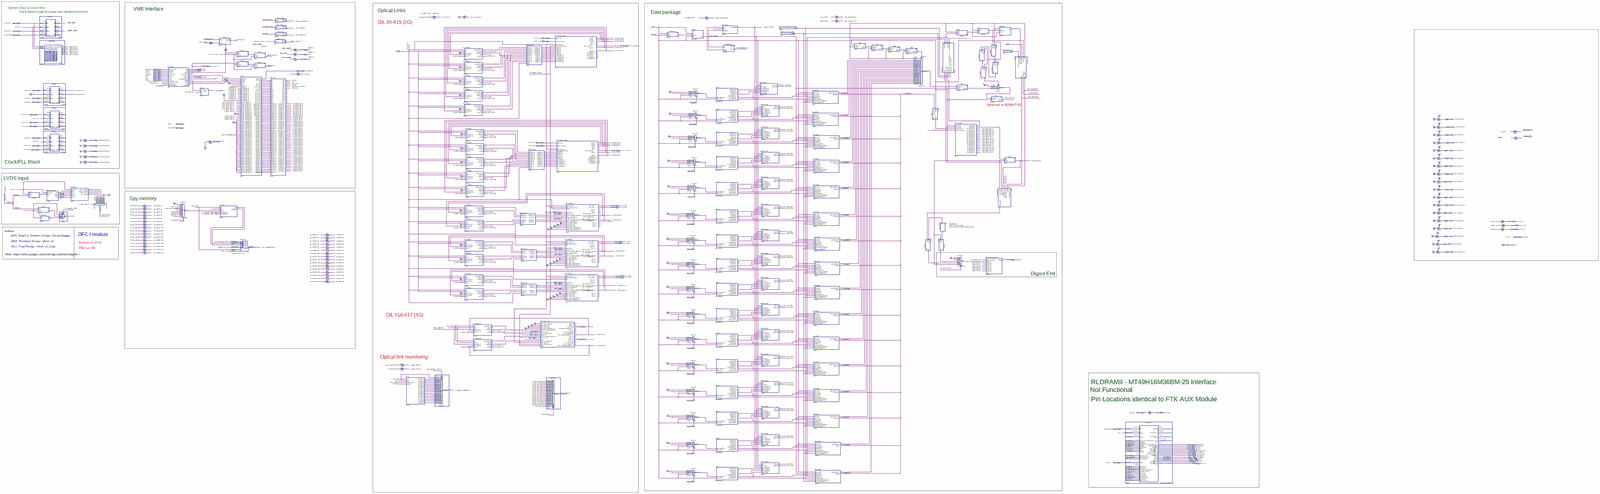
[diagram p0: schematic sheet, whole]
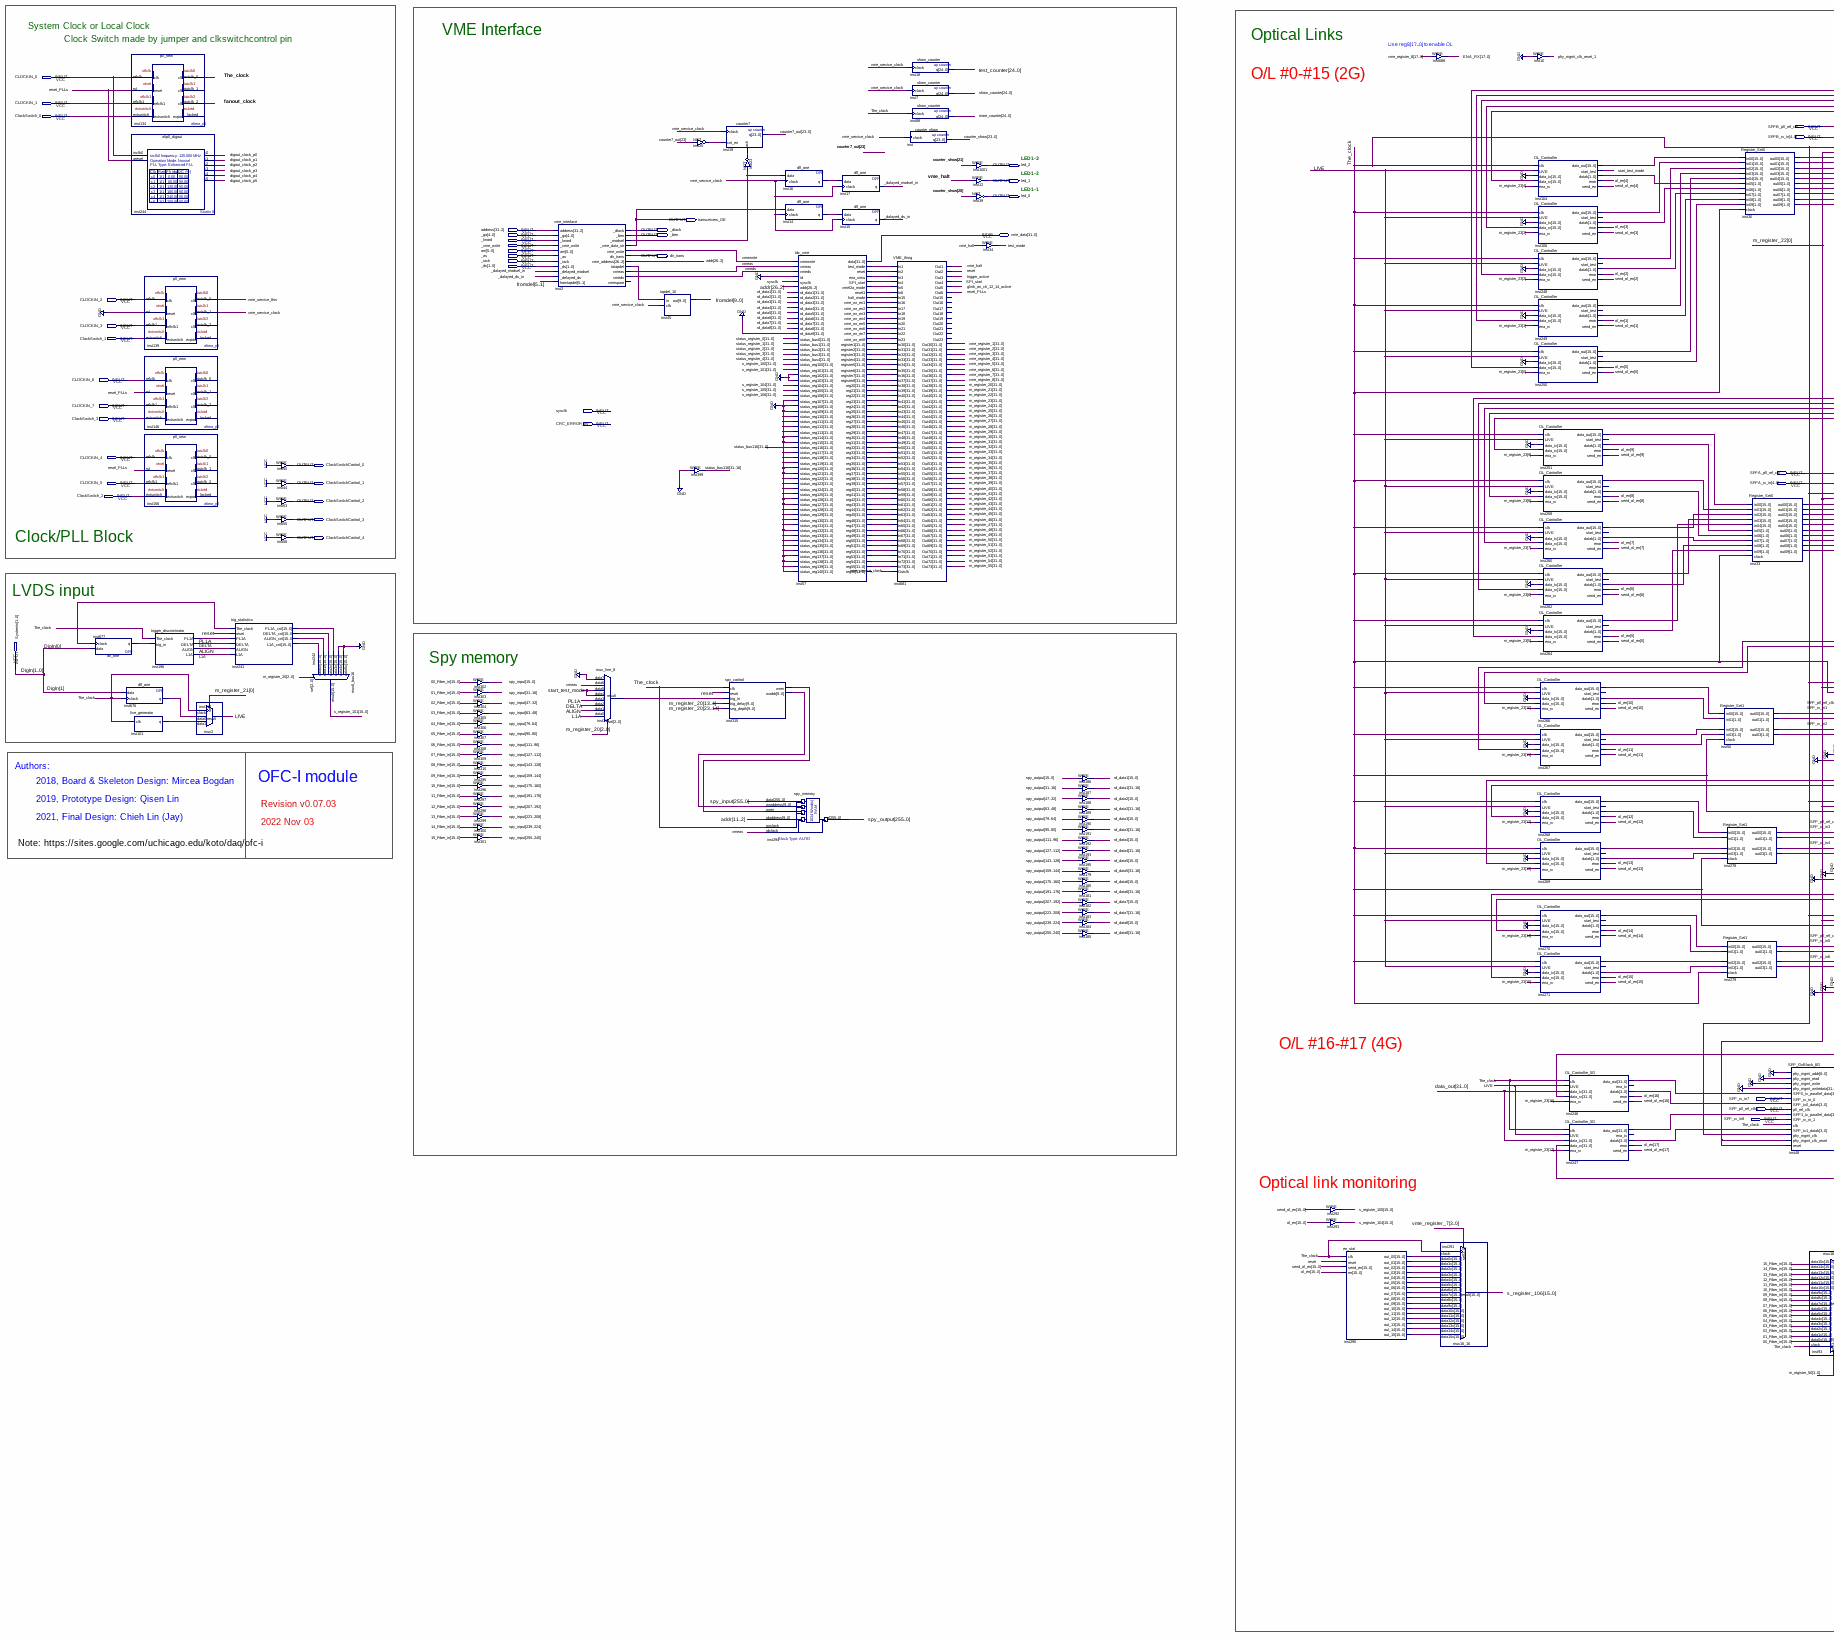
[diagram p1: schematic sheet, left part]
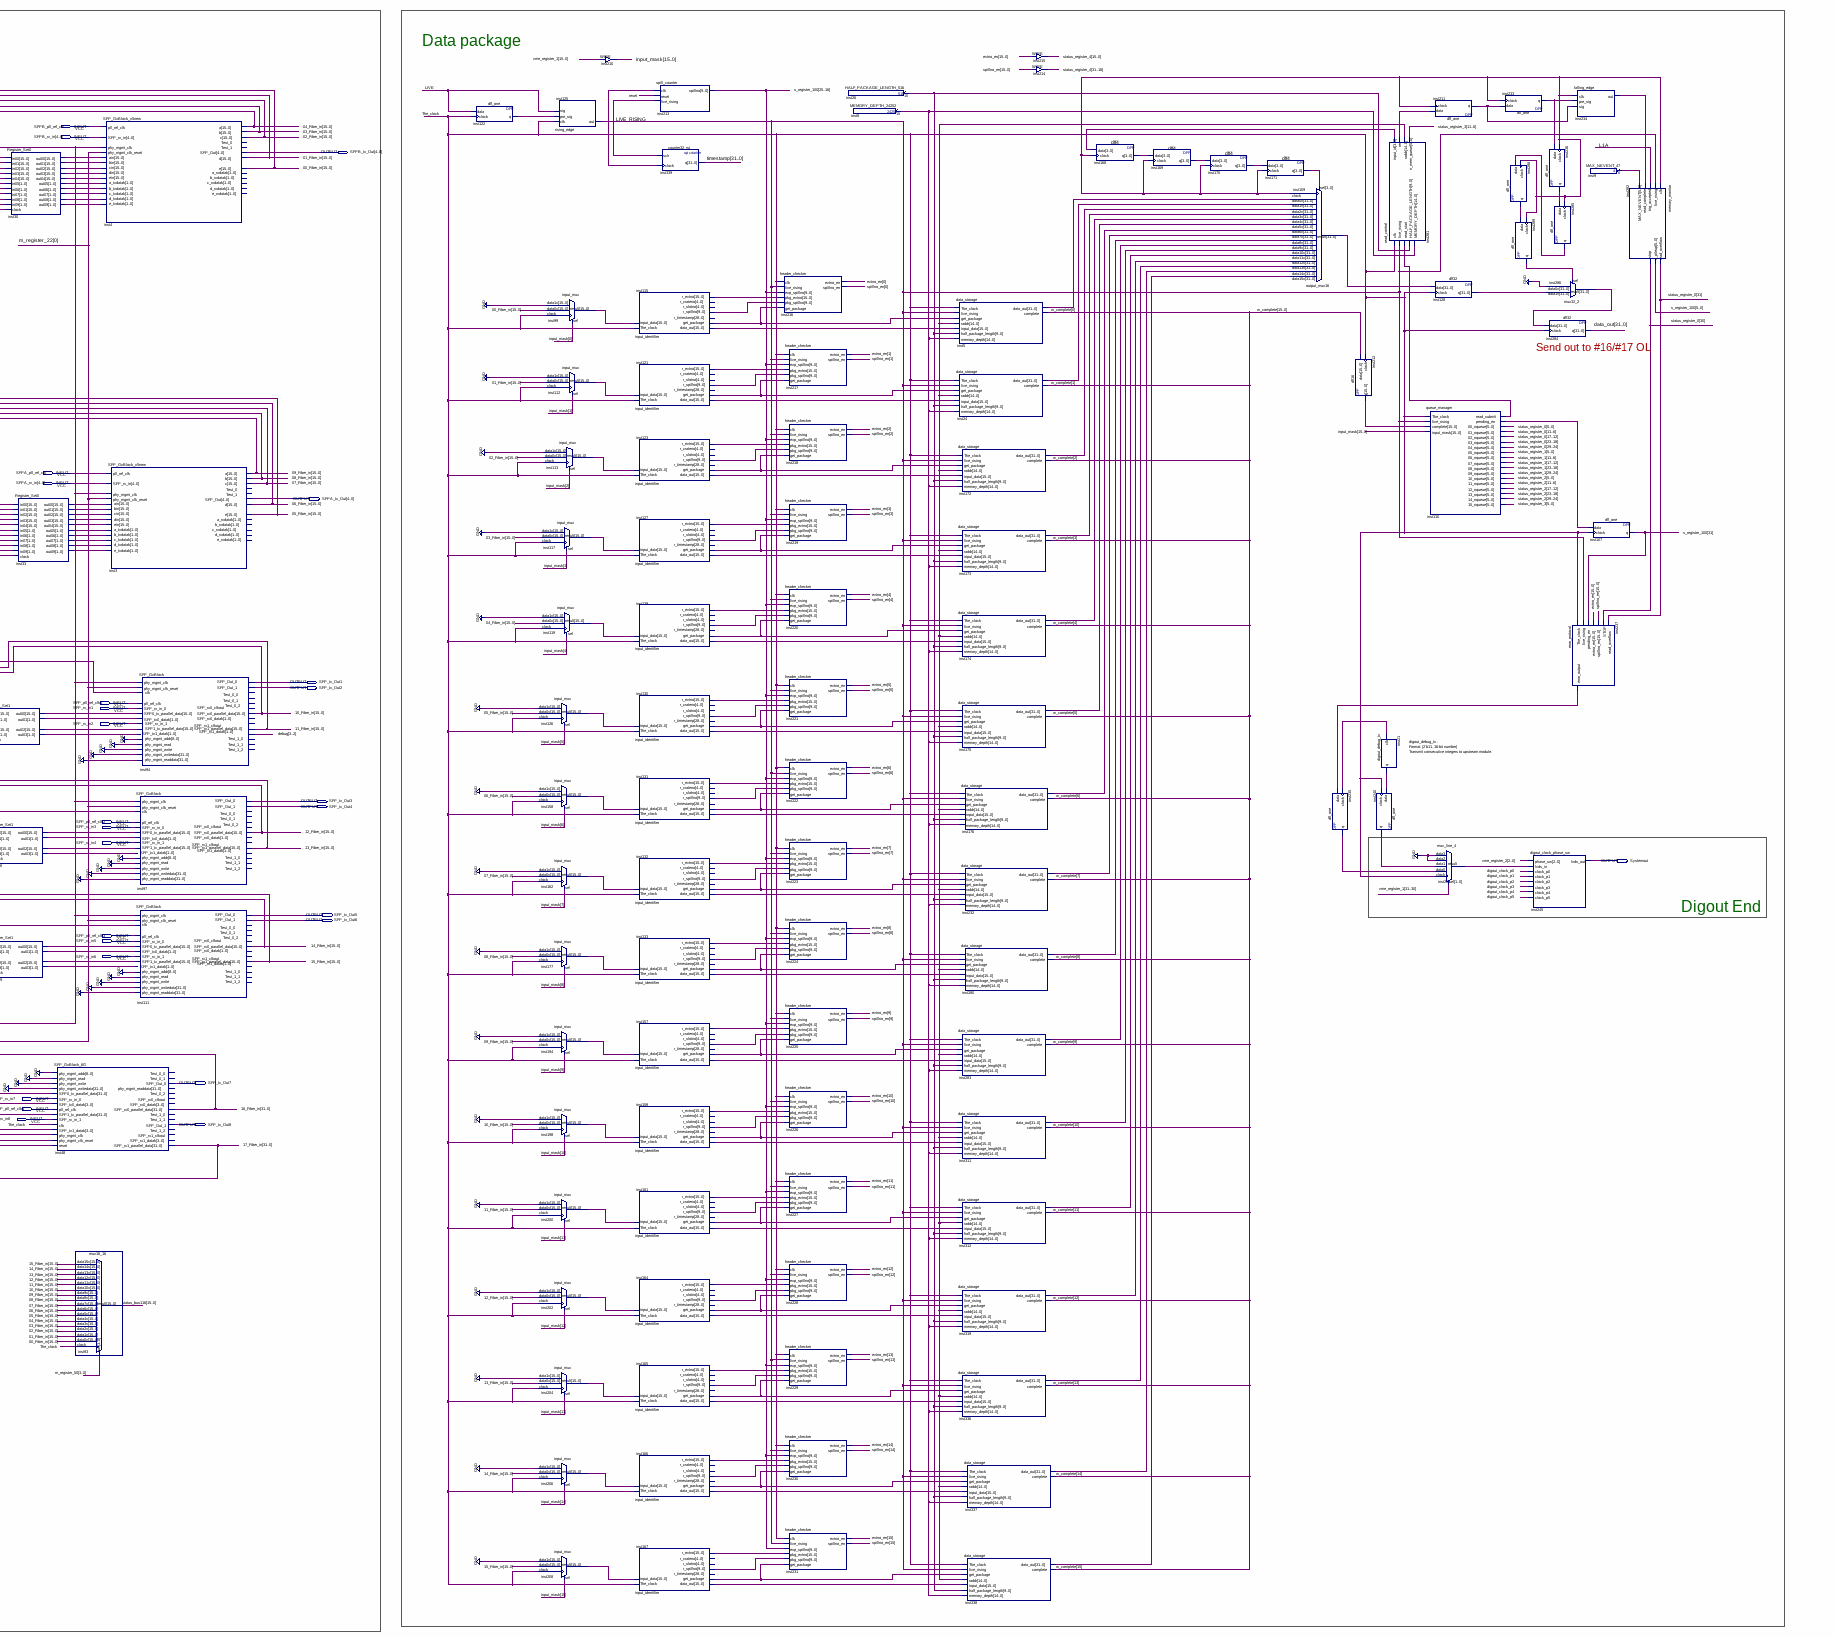
[diagram p2: schematic sheet, centre part]
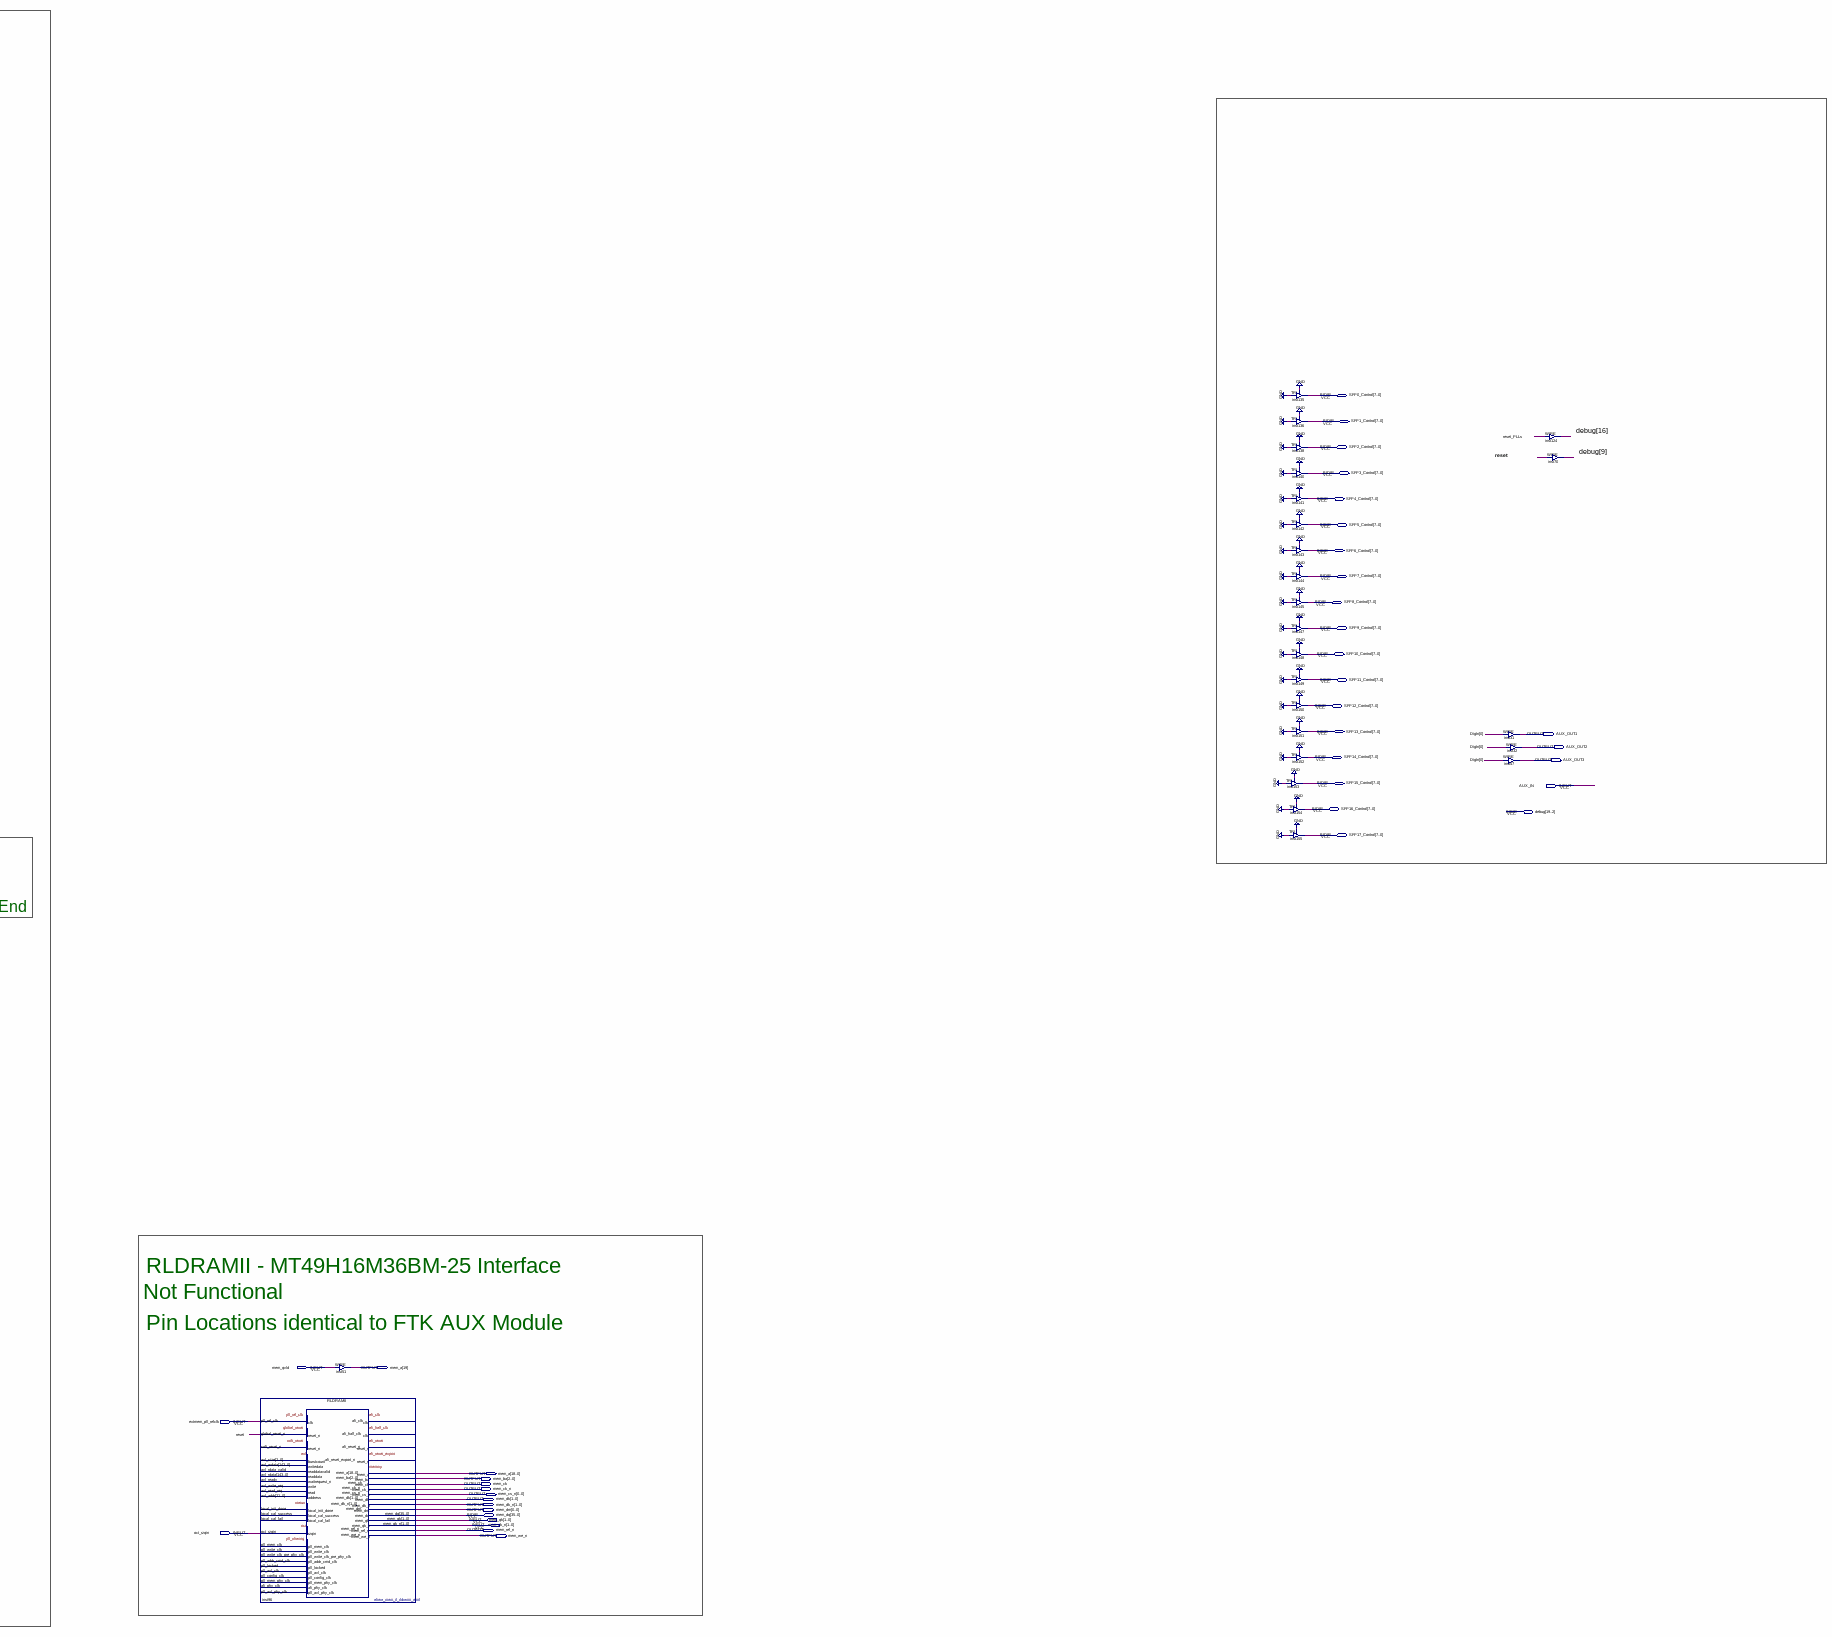
[diagram p3: schematic sheet, right part]
// Quartus schematic Rx.bdf as structural Verilog: 233 symbols, 103 pins
module Rx (
  input  CLOCKIN_0,
  input  CLOCKIN_1,
  input  ClockSwitch_0,
  input  SFPB_pll_ref_clk,
  input  [4:0] SFPB_rx_in,
  input  [31:2] address,
  input  [4:0] _ga,
  input  _lword,
  input  _vme_write,
  input  [5:0] am,
  input  _as,
  input  _iack,
  input  [1:0] _ds,
  input  CLOCKIN_2,
  input  CLOCKIN_3,
  input  ClockSwitch_1,
  input  CLOCKIN_6,
  input  CLOCKIN_7,
  input  sysclk,
  input  ClockSwitch_3,
  input  CRC_ERROR_IN,
  input  CLOCKIN_4,
  input  SFPA_pll_ref_clk,
  input  CLOCKIN_5,
  input  [4:0] SFPA_rx_in,
  input  ClockSwitch_2,
  input  [1:0] Systemin,
  input  SFP_pll_ref_clk1,
  input  SFP_rx_in1,
  input  SFP_rx_in2,
  input  AUX_IN,
  input  SFP_pll_ref_clk2,
  input  SFP_rx_in3,
  input  SFP_rx_in4,
  input  SFP_pll_ref_clk3,
  input  SFP_rx_in5,
  input  SFP_rx_in6,
  input  SFP_rx_in7,
  input  SFP_pll_ref_clk4,
  input  SFP_rx_in8,
  input  mem_qvld,
  input  extmem_pll_refclk,
  input  [1:0] mem_qk,
  input  [1:0] mem_qk_n,
  input  oct_rzqin,
  inout  [31:0] vme_data,
  inout  [7:0] SFP0_Control,
  inout  [7:0] SFP1_Control,
  inout  [7:0] SFP2_Control,
  inout  [7:0] SFP3_Control,
  inout  [7:0] SFP4_Control,
  inout  [7:0] SFP5_Control,
  inout  [7:0] SFP6_Control,
  inout  [7:0] SFP7_Control,
  inout  [7:0] SFP8_Control,
  inout  [7:0] SFP9_Control,
  inout  [7:0] SFP10_Control,
  inout  [7:0] SFP11_Control,
  inout  [7:0] SFP12_Control,
  inout  [7:0] SFP13_Control,
  inout  [7:0] SFP14_Control,
  inout  [7:0] SFP15_Control,
  inout  [7:0] SFP16_Control,
  inout  [19:2] debug,
  inout  [7:0] SFP17_Control,
  inout  [35:0] mem_dq,
  output [4:0] SFPB_tx_Out,
  output led_2,
  output led_1,
  output led_0,
  output transceivers_OE,
  output _dtack,
  output _berr,
  output dir_trans,
  output ClockSwitchControl_0,
  output ClockSwitchControl_1,
  output [4:0] SFPA_tx_Out,
  output ClockSwitchControl_2,
  output ClockSwitchControl_3,
  output ClockSwitchControl_4,
  output SFP_tx_Out1,
  output SFP_tx_Out2,
  output AUX_OUT1,
  output AUX_OUT2,
  output AUX_OUT3,
  output SFP_tx_Out3,
  output SFP_tx_Out4,
  output Systemout,
  output SFP_tx_Out5,
  output SFP_tx_Out6,
  output SFP_tx_Out7,
  output SFP_tx_Out8,
  output [19:0] mem_a,
  output [2:0] mem_ba,
  output mem_ck,
  output mem_ck_n,
  output [0:0] mem_cs_n,
  output [1:0] mem_dk,
  output [1:0] mem_dk_n,
  output [0:0] mem_dm,
  output mem_ref_n,
  output mem_we_n
);

  wire _dalayed_ds_in, _dalayed_modsel_in, ALIGN, DELTA, digout_clock_p0, digout_clock_p1, digout_clock_p2,
       digout_clock_p3, digout_clock_p4, digout_clock_p5, fanout_clock, glink_on_ch_12_14_active,
       inst2__modsel, inst2_totapdel, inst14_q, inst16_q, inst21_q, inst23_out, inst25_out, inst57_ena_simu,
       inst57_halt_mode, inst57_reset, inst57_reset1, inst57_spi_start, inst57_test_mode, inst57_vme_wr_en1,
       inst57_vme_wr_en2, inst57_vme_wr_en3, inst57_vme_wr_en4, inst57_vme_wr_en5, inst57_vme_wr_en6,
       inst57_vme_wr_en7, inst57_vme_wr_en8, inst57_vmel2a_mode, inst101_q, inst110_pending_err,
       inst110_read_submit, inst115_get_package, inst121_get_package, inst122_q, inst123_get_package,
       inst127_get_package, inst129_get_package, inst130_get_package, inst131_get_package,
       inst132_get_package, inst133_get_package, inst157_get_package, inst159_get_package,
       inst161_get_package, inst164_get_package, inst165_get_package, inst166_get_package,
       inst167_get_package, inst211_q, inst233_q, inst234_out, inst235_q, inst236_q, inst237_error_output,
       inst238_result, inst240_q, inst281_ren, inst285_q, inst288_q, inst289_q, inst313_result, inst315_wren,
       inst676_q, inst677_q, L1A, LIVE, LIVE_RISING, phy_mgmt_clk_reset_1, PL1A, reset, reset_PLLs,
       SPI_start, start_test_mode, test_mode, The_clock, trigger_active, vme_halt, vme_service_8ns,
       vme_service_clock, vmeas, vmeds, vmewrite;
  wire [1:0] inst30_out05, inst30_out06, inst30_out07, inst30_out08, inst30_out09, inst33_out05,
       inst33_out06, inst33_out07, inst33_out08, inst33_out09, inst50_out01, inst50_out03, inst104_datak,
       inst106_datak, inst248_datak, inst249_datak, inst250_datak, inst251_datak, inst258_datak,
       inst260_datak, inst262_datak, inst264_datak, inst266_datak, inst267_datak, inst268_datak,
       inst269_datak, inst270_datak, inst271_datak, inst278_out01, inst278_out03, inst279_out01,
       inst279_out03;
  wire [3:0] inst168_q, inst169_q, inst170_q, inst171_q, inst246_datak, inst247_datak, inst281_input_id;
  wire [5:0] inst9_result;
  wire [9:0] fromdel, inst26_result, inst115_r_spillno, inst121_r_spillno, inst123_r_spillno,
       inst127_r_spillno, inst129_r_spillno, inst130_r_spillno, inst131_r_spillno, inst132_r_spillno,
       inst133_r_spillno, inst157_r_spillno, inst159_r_spillno, inst161_r_spillno, inst164_r_spillno,
       inst165_r_spillno, inst166_r_spillno, inst167_r_spillno, inst315_waddr;
  wire [14:0] inst8_result, inst281_raddr;
  wire [15:0] \00_Fiber_in , \01_Fiber_in , \02_Fiber_in , \03_Fiber_in , \04_Fiber_in , \05_Fiber_in ,
       \06_Fiber_in , \07_Fiber_in , \08_Fiber_in , \09_Fiber_in , \10_Fiber_in , \11_Fiber_in ,
       \12_Fiber_in , \13_Fiber_in , \14_Fiber_in , \15_Fiber_in , evtno_err, input_mask, inst30_out00,
       inst30_out01, inst30_out02, inst30_out03, inst30_out04, inst33_out00, inst33_out01, inst33_out02,
       inst33_out03, inst33_out04, inst50_out00, inst50_out02, inst99_result, inst104_data_out,
       inst106_data_out, inst112_result, inst113_result, inst115_data_out, inst115_r_evtno, inst117_result,
       inst119_result, inst121_data_out, inst121_r_evtno, inst123_data_out, inst123_r_evtno, inst126_result,
       inst127_data_out, inst127_r_evtno, inst129_data_out, inst129_r_evtno, inst130_data_out,
       inst130_r_evtno, inst131_data_out, inst131_r_evtno, inst132_data_out, inst132_r_evtno,
       inst133_data_out, inst133_r_evtno, inst157_data_out, inst157_r_evtno, inst158_result,
       inst159_data_out, inst159_r_evtno, inst161_data_out, inst161_r_evtno, inst162_result,
       inst164_data_out, inst164_r_evtno, inst165_data_out, inst165_r_evtno, inst166_data_out,
       inst166_r_evtno, inst167_data_out, inst167_r_evtno, inst177_result, inst194_result, inst198_result,
       inst200_result, inst202_result, inst204_result, inst206_result, inst208_result, inst212_q,
       inst241_align_cnt, inst241_delta_cnt, inst241_l1a_cnt, inst241_pl1a_cnt, inst248_data_out,
       inst249_data_out, inst250_data_out, inst251_data_out, inst258_data_out, inst260_data_out,
       inst262_data_out, inst264_data_out, inst266_data_out, inst267_data_out, inst268_data_out,
       inst269_data_out, inst270_data_out, inst271_data_out, inst278_out00, inst278_out02, inst279_out00,
       inst279_out02, inst290_out_00, inst290_out_01, inst290_out_02, inst290_out_03, inst290_out_04,
       inst290_out_05, inst290_out_06, inst290_out_07, inst290_out_08, inst290_out_09, inst290_out_10,
       inst290_out_11, inst290_out_12, inst290_out_13, inst290_out_14, inst290_out_15, spillno_err,
       w_complete;
  wire [17:0] ENA_RX, ol_err, send_ol_err;
  wire [23:0] counter7_out, counter_show;
  wire [24:0] more_counter, show_counter, test_counter;
  wire [26:2] addr;
  wire [31:0] \16_Fiber_in , \17_Fiber_in , data_out, inst5_data_out, inst24_data_out, inst57_reg20,
       inst57_reg21, inst57_reg22, inst57_reg23, inst57_reg24, inst57_reg25, inst57_reg26, inst57_reg27,
       inst57_reg28, inst57_reg29, inst57_reg30, inst57_reg31, inst57_reg32, inst57_reg33, inst57_reg34,
       inst57_reg35, inst57_reg36, inst57_reg37, inst57_reg38, inst57_reg39, inst57_reg40, inst57_reg41,
       inst57_reg42, inst57_reg43, inst57_reg44, inst57_reg45, inst57_reg46, inst57_reg47, inst57_reg48,
       inst57_reg49, inst57_reg50, inst57_reg51, inst57_reg52, inst57_reg53, inst57_reg54, inst57_reg55,
       inst57_register1, inst57_register2, inst57_register3, inst57_register4, inst57_register5,
       inst57_register6, inst57_register7, inst57_register8, inst94_phy_mgmt_readdata,
       inst97_phy_mgmt_readdata, inst109_result, inst111_phy_mgmt_readdata, inst128_q, inst172_data_out,
       inst173_data_out, inst174_data_out, inst175_data_out, inst176_data_out, inst232_data_out,
       inst246_data_out, inst247_data_out, inst280_data_out, inst283_data_out, inst286_result,
       inst311_data_out, inst312_data_out, inst319_data_out, inst336_data_out, inst337_data_out,
       inst338_data_out, m_register_20, m_register_21, m_register_22, m_register_23, m_register_24,
       m_register_25, m_register_26, m_register_27, m_register_28, m_register_29, m_register_30,
       m_register_31, m_register_32, m_register_33, m_register_34, m_register_35, m_register_36,
       m_register_37, m_register_38, m_register_39, m_register_40, m_register_41, m_register_42,
       m_register_43, m_register_44, m_register_45, m_register_46, m_register_47, m_register_48,
       m_register_49, m_register_50, m_register_51, m_register_52, m_register_53, m_register_54,
       m_register_55, rd_data1, rd_data2, rd_data3, rd_data4, rd_data5, rd_data6, rd_data7, rd_data8,
       s_register_100, s_register_101, s_register_104, s_register_105, s_register_106, status_bus116,
       status_register_0, status_register_1, status_register_2, status_register_3, status_register_4,
       timestamp, vme_register_1, vme_register_2, vme_register_3, vme_register_4, vme_register_5,
       vme_register_6, vme_register_7, vme_register_8;
  wire [255:0] spy_input, spy_output;

  dff_one inst677 (.data(Systemin[0]), .clock(The_clock), .q(inst677_q));
  pll_new inst134 (
    .refclk(CLOCKIN_0), .rst(reset_PLLs), .refclk1(CLOCKIN_1), .extswitch(ClockSwitch_0),
    .outclk_0(The_clock), .outclk_2(fanout_clock));  // open: outclk_1, locked
  altpll_digout inst244 (
    .inclk0(CLOCKIN_0), .areset(reset_PLLs), .c0(digout_clock_p0), .c1(digout_clock_p1),
    .c2(digout_clock_p2), .c3(digout_clock_p3), .c4(digout_clock_p4), .c5(digout_clock_p5));
  dff_one inst676 (.data(Systemin[1]), .clock(The_clock), .q(inst676_q));
  live_generator inst101 (.clk(The_clock), .q(inst101_q));
  pll_new inst139 (
    .refclk(CLOCKIN_2), .rst(1'b0), .refclk1(CLOCKIN_3), .extswitch(ClockSwitch_1),
    .outclk_0(vme_service_8ns), .outclk_1(vme_service_clock));  // open: outclk_2, locked
  pll_new inst146 (
    .refclk(CLOCKIN_6), .rst(reset_PLLs), .refclk1(CLOCKIN_7), .extswitch(ClockSwitch_3));  // open: outclk_0, outclk_1, outclk_2, locked
  pll_new inst156 (
    .refclk(CLOCKIN_4), .rst(reset_PLLs), .refclk1(CLOCKIN_5), .extswitch(ClockSwitch_2));  // open: outclk_0, outclk_1, outclk_2, locked
  trigger_discriminator inst196 (
    .The_clock(The_clock), .trig_in(inst677_q), .PL1A(PL1A), .DELTA(DELTA), .ALIGN(ALIGN), .L1A(L1A));
  mux2 inst114 (.data1(inst101_q), .data0(inst676_q), .clock(The_clock), .sel(m_register_21[0]), .result(LIVE));
  trig_statistics inst241 (
    .The_clock(The_clock), .reset(reset), .PL1A(PL1A), .DELTA(DELTA), .ALIGN(ALIGN), .L1A(L1A),
    .PL1A_cnt(inst241_pl1a_cnt), .DELTA_cnt(inst241_delta_cnt), .ALIGN_cnt(inst241_align_cnt),
    .L1A_cnt(inst241_l1a_cnt));
  assign ClockSwitchControl_0 = 1'b1;  // WIRE inst40
  assign ClockSwitchControl_1 = 1'b1;  // WIRE inst44
  assign ClockSwitchControl_2 = 1'b1;  // WIRE inst53
  assign ClockSwitchControl_3 = 1'b1;  // WIRE inst55
  assign ClockSwitchControl_4 = 1'b1;  // WIRE inst58
  mux6_bus16 inst242 (
    .data5x({16{1'b0}}), .data4x({16{1'b0}}), .data3x(inst241_pl1a_cnt), .data2x(inst241_delta_cnt),
    .data1x(inst241_align_cnt), .data0x(inst241_l1a_cnt), .sel(m_register_20[2:0]),
    .result(s_register_101[15:0]));
  assign spy_input[15:0] = \00_Fiber_in ;  // WIRE inst302
  assign spy_input[31:16] = \01_Fiber_in ;  // WIRE inst303
  assign spy_input[47:32] = \02_Fiber_in ;  // WIRE inst304
  assign spy_input[63:48] = \03_Fiber_in ;  // WIRE inst305
  assign spy_input[79:64] = \04_Fiber_in ;  // WIRE inst306
  assign spy_input[95:80] = \05_Fiber_in ;  // WIRE inst307
  assign spy_input[111:96] = \06_Fiber_in ;  // WIRE inst308
  assign spy_input[127:112] = \07_Fiber_in ;  // WIRE inst309
  assign spy_input[143:128] = \08_Fiber_in ;  // WIRE inst310
  assign spy_input[159:144] = \09_Fiber_in ;  // WIRE inst295
  assign spy_input[175:160] = \10_Fiber_in ;  // WIRE inst296
  assign spy_input[191:176] = \11_Fiber_in ;  // WIRE inst297
  assign spy_input[207:192] = \12_Fiber_in ;  // WIRE inst298
  assign spy_input[223:208] = \13_Fiber_in ;  // WIRE inst299
  assign spy_input[239:224] = \14_Fiber_in ;  // WIRE inst300
  assign spy_input[255:240] = \15_Fiber_in ;  // WIRE inst301
  vme_interface inst2 (
    .address(address), ._ga(_ga), ._lword(_lword), ._vme_write(_vme_write), .am(am), ._as(_as),
    ._iack(_iack), ._ds(_ds), ._delayed_modsel(_dalayed_modsel_in), ._delayed_ds(_dalayed_ds_in),
    .fromtapdel(fromdel[5:1]), ._modsel(inst2__modsel), ._vme_data_str(transceivers_OE),
    .vme_write(vmewrite), .dir_trans(dir_trans), .vme_address(addr), .totapdel(inst2_totapdel),
    .vmeas(vmeas), .vmeds(vmeds), ._dtack(_dtack), ._berr(_berr));  // open: vmespare
  mux_line_8 inst313 (
    .data7(1'b0), .data6(vmeas), .data5(start_test_mode), .data4(start_test_mode), .data3(PL1A),
    .data2(DELTA), .data1(ALIGN), .data0(L1A), .sel(m_register_20[2:0]), .result(inst313_result));
  tapdel_10 inst45 (.in(inst2_totapdel), .clk(vme_service_clock), .out(fromdel));
  not inst25 (inst25_out, counter7_out[23]);
  assign status_bus116[31:16] = {16{1'b0}};  // WIRE inst399
  counter7 inst19 (.clock(vme_service_clock), .cnt_en(inst25_out), .aclr(inst23_out), .q(counter7_out));
  spy_control inst315 (
    .clk(The_clock), .reset(reset), .trig_in(inst313_result), .trig_delay(m_register_20[13:4]),
    .seg_depth(m_register_20[23:14]), .wren(inst315_wren), .waddr(inst315_waddr));
  not inst23 (inst23_out, inst2__modsel);
  dff_one inst16 (.data(inst2__modsel), .clock(vme_service_clock), .q(inst16_q));
  dff_one inst14 (.data(transceivers_OE), .clock(vme_service_clock), .q(inst14_q));
  spy_memory inst294 (
    .data(spy_input), .wraddress(inst315_waddr), .wren(inst315_wren), .rdaddress(addr[11:2]),
    .wrclock(The_clock), .rdclock(vmeas), .q(spy_output));
  tdc_vme inst57 (
    .vmewrite(vmewrite), .vmeas(vmeas), .vmeds(vmeds), .id(1'b0), .sysclk(sysclk), .addr(addr),
    .rd_data1(rd_data1), .rd_data2(rd_data2), .rd_data3(rd_data3), .rd_data4(rd_data4), .rd_data5(rd_data5),
    .rd_data6(rd_data6), .rd_data7(rd_data7), .rd_data8(rd_data8), .rd_data9({32{1'b0}}),
    .status_bus0(status_register_0), .status_bus1(status_register_1), .status_bus2(status_register_2),
    .status_bus3(status_register_3), .status_bus4(status_register_4), .status_reg100(s_register_100),
    .status_reg101(s_register_101), .status_reg102({32{1'b0}}), .status_reg103({32{1'b0}}),
    .status_reg104(s_register_104), .status_reg105(s_register_105), .status_reg106(s_register_106),
    .status_reg107({32{1'b0}}), .status_reg108({32{1'b0}}), .status_reg109({32{1'b0}}),
    .status_reg110({32{1'b0}}), .status_reg111({32{1'b0}}), .status_reg112({32{1'b0}}),
    .status_reg113({32{1'b0}}), .status_reg114({32{1'b0}}), .status_reg115({32{1'b0}}),
    .status_reg116(status_bus116), .status_reg117({32{1'b0}}), .status_reg118({32{1'b0}}),
    .status_reg119({32{1'b0}}), .status_reg120({32{1'b0}}), .status_reg121({32{1'b0}}),
    .status_reg122({32{1'b0}}), .status_reg123({32{1'b0}}), .status_reg124({32{1'b0}}),
    .status_reg125({32{1'b0}}), .status_reg126({32{1'b0}}), .status_reg127({32{1'b0}}),
    .status_reg128({32{1'b0}}), .status_reg129({32{1'b0}}), .status_reg130({32{1'b0}}),
    .status_reg131({32{1'b0}}), .status_reg132({32{1'b0}}), .status_reg133({32{1'b0}}),
    .status_reg134({32{1'b0}}), .status_reg135({32{1'b0}}), .status_reg136({32{1'b0}}),
    .status_reg137({32{1'b0}}), .status_reg138({32{1'b0}}), .status_reg139({32{1'b0}}),
    .status_reg140({32{1'b0}}), .test_mode(inst57_test_mode), .reset(inst57_reset),
    .ena_simu(inst57_ena_simu), .SPI_start(inst57_spi_start), .vmel2a_mode(inst57_vmel2a_mode),
    .reset1(inst57_reset1), .halt_mode(inst57_halt_mode), .vme_wr_en1(inst57_vme_wr_en1),
    .vme_wr_en2(inst57_vme_wr_en2), .vme_wr_en3(inst57_vme_wr_en3), .vme_wr_en4(inst57_vme_wr_en4),
    .vme_wr_en5(inst57_vme_wr_en5), .vme_wr_en6(inst57_vme_wr_en6), .vme_wr_en7(inst57_vme_wr_en7),
    .vme_wr_en8(inst57_vme_wr_en8), .register1(inst57_register1), .register2(inst57_register2),
    .register3(inst57_register3), .register4(inst57_register4), .register5(inst57_register5),
    .register6(inst57_register6), .register7(inst57_register7), .register8(inst57_register8),
    .reg20(inst57_reg20), .reg21(inst57_reg21), .reg22(inst57_reg22), .reg23(inst57_reg23),
    .reg24(inst57_reg24), .reg25(inst57_reg25), .reg26(inst57_reg26), .reg27(inst57_reg27),
    .reg28(inst57_reg28), .reg29(inst57_reg29), .reg30(inst57_reg30), .reg31(inst57_reg31),
    .reg32(inst57_reg32), .reg33(inst57_reg33), .reg34(inst57_reg34), .reg35(inst57_reg35),
    .reg36(inst57_reg36), .reg37(inst57_reg37), .reg38(inst57_reg38), .reg39(inst57_reg39),
    .reg40(inst57_reg40), .reg41(inst57_reg41), .reg42(inst57_reg42), .reg43(inst57_reg43),
    .reg44(inst57_reg44), .reg45(inst57_reg45), .reg46(inst57_reg46), .reg47(inst57_reg47),
    .reg48(inst57_reg48), .reg49(inst57_reg49), .reg50(inst57_reg50), .reg51(inst57_reg51),
    .reg52(inst57_reg52), .reg53(inst57_reg53), .reg54(inst57_reg54), .reg55(inst57_reg55), .data(vme_data));  // open: reg56
  dff_one inst17 (.data(inst16_q), .clock(vme_service_clock), .q(_dalayed_modsel_in));
  dff_one inst15 (.data(inst14_q), .clock(vme_service_clock), .q(_dalayed_ds_in));
  counter_show inst (.clock(vme_service_clock), .q(counter_show));
  VME_thing inst681 (
    .In1(inst57_test_mode), .In2(inst57_reset), .In3(inst57_ena_simu), .In4(inst57_spi_start),
    .In5(inst57_vmel2a_mode), .In6(inst57_reset1), .In15(inst57_halt_mode), .In16(inst57_vme_wr_en1),
    .In17(inst57_vme_wr_en2), .In18(inst57_vme_wr_en3), .In19(inst57_vme_wr_en4), .In20(inst57_vme_wr_en5),
    .In21(inst57_vme_wr_en6), .In22(inst57_vme_wr_en7), .In23(inst57_vme_wr_en8), .In30(inst57_register1),
    .In31(inst57_register2), .In32(inst57_register3), .In33(inst57_register4), .In34(inst57_register5),
    .In35(inst57_register6), .In36(inst57_register7), .In37(inst57_register8), .In38(inst57_reg20),
    .In39(inst57_reg21), .In40(inst57_reg22), .In41(inst57_reg23), .In42(inst57_reg24), .In43(inst57_reg25),
    .In44(inst57_reg26), .In45(inst57_reg27), .In46(inst57_reg28), .In47(inst57_reg29), .In48(inst57_reg30),
    .In49(inst57_reg31), .In50(inst57_reg32), .In51(inst57_reg33), .In52(inst57_reg34), .In53(inst57_reg35),
    .In54(inst57_reg36), .In55(inst57_reg37), .In56(inst57_reg38), .In57(inst57_reg39), .In58(inst57_reg40),
    .In59(inst57_reg41), .In60(inst57_reg42), .In61(inst57_reg43), .In62(inst57_reg44), .In63(inst57_reg45),
    .In64(inst57_reg46), .In65(inst57_reg47), .In66(inst57_reg48), .In67(inst57_reg49), .In68(inst57_reg50),
    .In69(inst57_reg51), .In70(inst57_reg52), .In71(inst57_reg53), .In72(inst57_reg54), .In73(inst57_reg55),
    .Outclk(vme_service_clock), .Out1(vme_halt), .Out2(reset), .Out3(trigger_active), .Out4(SPI_start),
    .Out5(glink_on_ch_12_14_active), .Out6(reset_PLLs), .Out30(vme_register_1), .Out31(vme_register_2),
    .Out32(vme_register_3), .Out33(vme_register_4), .Out34(vme_register_5), .Out35(vme_register_6),
    .Out36(vme_register_7), .Out37(vme_register_8), .Out38(m_register_20), .Out39(m_register_21),
    .Out40(m_register_22), .Out41(m_register_23), .Out42(m_register_24), .Out43(m_register_25),
    .Out44(m_register_26), .Out45(m_register_27), .Out46(m_register_28), .Out47(m_register_29),
    .Out48(m_register_30), .Out49(m_register_31), .Out50(m_register_32), .Out51(m_register_33),
    .Out52(m_register_34), .Out53(m_register_35), .Out54(m_register_36), .Out55(m_register_37),
    .Out56(m_register_38), .Out57(m_register_39), .Out58(m_register_40), .Out59(m_register_41),
    .Out60(m_register_42), .Out61(m_register_43), .Out62(m_register_44), .Out63(m_register_45),
    .Out64(m_register_46), .Out65(m_register_47), .Out66(m_register_48), .Out67(m_register_49),
    .Out68(m_register_50), .Out69(m_register_51), .Out70(m_register_52), .Out71(m_register_53),
    .Out72(m_register_54), .Out73(m_register_55));  // open: Out15, Out16, Out17, Out18, Out19, Out20, Out21, Out22, Out23
  show_counter inst18 (.clock(vme_service_clock), .q(test_counter));
  show_counter inst7 (.clock(vme_service_clock), .q(show_counter));
  show_counter inst88 (.clock(The_clock), .q(more_counter));
  assign led_2 = counter_show[21];  // WIRE inst1001
  assign led_1 = vme_halt;  // WIRE inst12
  not inst39 (led_0, counter_show[20]);
  assign test_mode = vme_halt;  // WIRE inst34
  assign rd_data1[15:0] = spy_output[15:0];  // WIRE inst186
  assign rd_data1[31:16] = spy_output[31:16];  // WIRE inst187
  assign rd_data2[15:0] = spy_output[47:32];  // WIRE inst188
  assign rd_data2[31:16] = spy_output[63:48];  // WIRE inst189
  assign rd_data3[15:0] = spy_output[79:64];  // WIRE inst190
  assign rd_data3[31:16] = spy_output[95:80];  // WIRE inst191
  assign rd_data4[15:0] = spy_output[111:96];  // WIRE inst192
  assign rd_data4[31:16] = spy_output[127:112];  // WIRE inst193
  assign rd_data5[15:0] = spy_output[143:128];  // WIRE inst195
  assign rd_data5[31:16] = spy_output[159:144];  // WIRE inst179
  assign rd_data6[15:0] = spy_output[175:160];  // WIRE inst180
  assign rd_data6[31:16] = spy_output[191:176];  // WIRE inst181
  assign rd_data7[15:0] = spy_output[207:192];  // WIRE inst182
  assign rd_data7[31:16] = spy_output[223:208];  // WIRE inst183
  assign rd_data8[15:0] = spy_output[239:224];  // WIRE inst184
  assign rd_data8[31:16] = spy_output[255:240];  // WIRE inst185
  assign s_register_105[15:0] = send_ol_err[15:0];  // WIRE inst292
  assign s_register_104[15:0] = ol_err[15:0];  // WIRE inst293
  err_stat inst290 (
    .clk(The_clock), .reset(reset), .send_err(send_ol_err[15:0]), .err(ol_err[15:0]),
    .out_00(inst290_out_00), .out_01(inst290_out_01), .out_02(inst290_out_02), .out_03(inst290_out_03),
    .out_04(inst290_out_04), .out_05(inst290_out_05), .out_06(inst290_out_06), .out_07(inst290_out_07),
    .out_08(inst290_out_08), .out_09(inst290_out_09), .out_10(inst290_out_10), .out_11(inst290_out_11),
    .out_12(inst290_out_12), .out_13(inst290_out_13), .out_14(inst290_out_14), .out_15(inst290_out_15));
  assign ENA_RX = vme_register_8[17:0];  // WIRE inst688
  mux16_16 inst291 (
    .data15x(inst290_out_15), .data14x(inst290_out_14), .data13x(inst290_out_13), .data12x(inst290_out_12),
    .data11x(inst290_out_11), .data10x(inst290_out_10), .data9x(inst290_out_09), .data8x(inst290_out_08),
    .data7x(inst290_out_07), .data6x(inst290_out_06), .data5x(inst290_out_05), .data4x(inst290_out_04),
    .data3x(inst290_out_03), .data2x(inst290_out_02), .data1x(inst290_out_01), .data0x(inst290_out_00),
    .clock(The_clock), .sel(vme_register_7[3:0]), .result(s_register_106[15:0]));
  assign phy_mgmt_clk_reset_1 = 1'b0;  // WIRE inst10
  OL_Controller inst104 (
    .clk(The_clock), .LIVE(LIVE), .data_tx({16{1'b0}}), .data_rx(\04_Fiber_in ), .ena_rx(m_register_23[4]),
    .data_out(inst104_data_out), .start_test(start_test_mode), .datak(inst104_datak), .error(ol_err[4]),
    .send_err(send_ol_err[4]));
  OL_Controller inst106 (
    .clk(The_clock), .LIVE(LIVE), .data_tx({16{1'b0}}), .data_rx(\03_Fiber_in ), .ena_rx(m_register_23[3]),
    .data_out(inst106_data_out), .datak(inst106_datak), .error(ol_err[3]), .send_err(send_ol_err[3]));  // open: start_test
  OL_Controller inst248 (
    .clk(The_clock), .LIVE(LIVE), .data_tx({16{1'b0}}), .data_rx(\02_Fiber_in ), .ena_rx(m_register_23[2]),
    .data_out(inst248_data_out), .datak(inst248_datak), .error(ol_err[2]), .send_err(send_ol_err[2]));  // open: start_test
  OL_Controller inst249 (
    .clk(The_clock), .LIVE(LIVE), .data_tx({16{1'b0}}), .data_rx(\01_Fiber_in ), .ena_rx(m_register_23[1]),
    .data_out(inst249_data_out), .datak(inst249_datak), .error(ol_err[1]), .send_err(send_ol_err[1]));  // open: start_test
  OL_Controller inst250 (
    .clk(The_clock), .LIVE(LIVE), .data_tx({16{1'b0}}), .data_rx(\00_Fiber_in ), .ena_rx(m_register_23[0]),
    .data_out(inst250_data_out), .datak(inst250_datak), .error(ol_err[0]), .send_err(send_ol_err[0]));  // open: start_test
  OL_Controller inst251 (
    .clk(The_clock), .LIVE(LIVE), .data_tx({16{1'b0}}), .data_rx(\09_Fiber_in ), .ena_rx(m_register_23[9]),
    .data_out(inst251_data_out), .datak(inst251_datak), .error(ol_err[9]), .send_err(send_ol_err[9]));  // open: start_test
  OL_Controller inst258 (
    .clk(The_clock), .LIVE(LIVE), .data_tx({16{1'b0}}), .data_rx(\08_Fiber_in ), .ena_rx(m_register_23[8]),
    .data_out(inst258_data_out), .datak(inst258_datak), .error(ol_err[8]), .send_err(send_ol_err[8]));  // open: start_test
  OL_Controller inst260 (
    .clk(The_clock), .LIVE(LIVE), .data_tx({16{1'b0}}), .data_rx(\07_Fiber_in ), .ena_rx(m_register_23[7]),
    .data_out(inst260_data_out), .datak(inst260_datak), .error(ol_err[7]), .send_err(send_ol_err[7]));  // open: start_test
  OL_Controller inst262 (
    .clk(The_clock), .LIVE(LIVE), .data_tx({16{1'b0}}), .data_rx(\06_Fiber_in ), .ena_rx(m_register_23[6]),
    .data_out(inst262_data_out), .datak(inst262_datak), .error(ol_err[6]), .send_err(send_ol_err[6]));  // open: start_test
  OL_Controller inst264 (
    .clk(The_clock), .LIVE(LIVE), .data_tx({16{1'b0}}), .data_rx(\05_Fiber_in ), .ena_rx(m_register_23[5]),
    .data_out(inst264_data_out), .datak(inst264_datak), .error(ol_err[5]), .send_err(send_ol_err[5]));  // open: start_test
  OL_Controller inst266 (
    .clk(The_clock), .LIVE(LIVE), .data_tx({16{1'b0}}), .data_rx(\10_Fiber_in ), .ena_rx(m_register_23[10]),
    .data_out(inst266_data_out), .datak(inst266_datak), .error(ol_err[10]), .send_err(send_ol_err[10]));  // open: start_test
  OL_Controller inst267 (
    .clk(The_clock), .LIVE(LIVE), .data_tx({16{1'b0}}), .data_rx(\11_Fiber_in ), .ena_rx(m_register_23[11]),
    .data_out(inst267_data_out), .datak(inst267_datak), .error(ol_err[11]), .send_err(send_ol_err[11]));  // open: start_test
  OL_Controller inst268 (
    .clk(The_clock), .LIVE(LIVE), .data_tx({16{1'b0}}), .data_rx(\12_Fiber_in ), .ena_rx(m_register_23[12]),
    .data_out(inst268_data_out), .datak(inst268_datak), .error(ol_err[12]), .send_err(send_ol_err[12]));  // open: start_test
  OL_Controller inst269 (
    .clk(The_clock), .LIVE(LIVE), .data_tx({16{1'b0}}), .data_rx(\13_Fiber_in ), .ena_rx(m_register_23[13]),
    .data_out(inst269_data_out), .datak(inst269_datak), .error(ol_err[13]), .send_err(send_ol_err[13]));  // open: start_test
  OL_Controller inst270 (
    .clk(The_clock), .LIVE(LIVE), .data_tx({16{1'b0}}), .data_rx(\14_Fiber_in ), .ena_rx(m_register_23[14]),
    .data_out(inst270_data_out), .datak(inst270_datak), .error(ol_err[14]), .send_err(send_ol_err[14]));  // open: start_test
  OL_Controller inst271 (
    .clk(The_clock), .LIVE(LIVE), .data_tx({16{1'b0}}), .data_rx(\15_Fiber_in ), .ena_rx(m_register_23[15]),
    .data_out(inst271_data_out), .datak(inst271_datak), .error(ol_err[15]), .send_err(send_ol_err[15]));  // open: start_test
  OL_Controller_5G inst246 (
    .clk(The_clock), .LIVE(LIVE), .data_tx(data_out), .data_rx(\16_Fiber_in ), .ena_rx(m_register_23[16]),
    .data_out(inst246_data_out), .datak(inst246_datak), .error(ol_err[16]), .send_err(send_ol_err[16]));  // open: ena_tx
  OL_Controller_5G inst247 (
    .clk(The_clock), .LIVE(LIVE), .data_tx(data_out), .data_rx(\17_Fiber_in ), .ena_rx(m_register_23[17]),
    .data_out(inst247_data_out), .datak(inst247_datak), .error(ol_err[17]), .send_err(send_ol_err[17]));  // open: ena_tx
  Register_Set1 inst50 (
    .in00(inst266_data_out), .in01(inst266_datak), .in02(inst267_data_out), .in03(inst267_datak),
    .clock(The_clock), .out00(inst50_out00), .out01(inst50_out01), .out02(inst50_out02), .out03(inst50_out03));
  Register_Set1 inst278 (
    .in00(inst268_data_out), .in01(inst268_datak), .in02(inst269_data_out), .in03(inst269_datak),
    .clock(The_clock), .out00(inst278_out00), .out01(inst278_out01), .out02(inst278_out02),
    .out03(inst278_out03));
  Register_Set1 inst279 (
    .in00(inst270_data_out), .in01(inst270_datak), .in02(inst271_data_out), .in03(inst271_datak),
    .clock(The_clock), .out00(inst279_out00), .out01(inst279_out01), .out02(inst279_out02),
    .out03(inst279_out03));
  Register_Set0 inst30 (
    .in00(inst104_data_out), .in01(inst106_data_out), .in02(inst248_data_out), .in03(inst249_data_out),
    .in04(inst250_data_out), .in05(inst104_datak), .in06(inst106_datak), .in07(inst248_datak),
    .in08(inst249_datak), .in09(inst250_datak), .clock(The_clock), .out00(inst30_out00),
    .out01(inst30_out01), .out02(inst30_out02), .out03(inst30_out03), .out04(inst30_out04),
    .out05(inst30_out05), .out06(inst30_out06), .out07(inst30_out07), .out08(inst30_out08),
    .out09(inst30_out09));
  Register_Set0 inst33 (
    .in00(inst251_data_out), .in01(inst258_data_out), .in02(inst260_data_out), .in03(inst262_data_out),
    .in04(inst264_data_out), .in05(inst251_datak), .in06(inst258_datak), .in07(inst260_datak),
    .in08(inst262_datak), .in09(inst264_datak), .clock(The_clock), .out00(inst33_out00),
    .out01(inst33_out01), .out02(inst33_out02), .out03(inst33_out03), .out04(inst33_out04),
    .out05(inst33_out05), .out06(inst33_out06), .out07(inst33_out07), .out08(inst33_out08),
    .out09(inst33_out09));
  SFP_GxBlock_6G inst48 (
    .phy_mgmt_addr({9{1'b0}}), .phy_mgmt_read(1'b0), .phy_mgmt_write(1'b0), .phy_mgmt_writedata({32{1'b0}}),
    .SFP0_tx_parallel_data(inst246_data_out), .SFP_rx_in_0(SFP_rx_in7), .SFP_tx0_datak(inst246_datak),
    .pll_ref_clk(SFP_pll_ref_clk4), .SFP1_tx_parallel_data(inst247_data_out), .SFP_rx_in_1(SFP_rx_in8),
    .clk(The_clock), .SFP_tx1_datak(inst247_datak), .phy_mgmt_clk(The_clock),
    .phy_mgmt_clk_reset(m_register_22[0]), .reset(m_register_22[0]), .SFP_Out_0(SFP_tx_Out7),
    .SFP_rx0_parallel_data(\16_Fiber_in ), .SFP_Out_1(SFP_tx_Out8), .SFP_rx1_parallel_data(\17_Fiber_in ));  // open: Test_0_0, Test_0_1, phy_mgmt_readdata, Test_0_2, SFP_rx0_clkout, SFP_rx0_datak, Test_1_0, Test_1_1, Test_1_2, SFP_rx1_clkout, SFP_rx1_datak
  mux16_16 inst93 (
    .data15x(\15_Fiber_in ), .data14x(\14_Fiber_in ), .data13x(\13_Fiber_in ), .data12x(\12_Fiber_in ),
    .data11x(\11_Fiber_in ), .data10x(\10_Fiber_in ), .data9x(\09_Fiber_in ), .data8x(\08_Fiber_in ),
    .data7x(\07_Fiber_in ), .data6x(\06_Fiber_in ), .data5x(\05_Fiber_in ), .data4x(\04_Fiber_in ),
    .data3x(\03_Fiber_in ), .data2x(\02_Fiber_in ), .data1x(\01_Fiber_in ), .data0x(\00_Fiber_in ),
    .clock(The_clock), .sel(m_register_50[3:0]), .result(status_bus116[15:0]));
  SFP_GxBlock_x5new inst4 (
    .pll_ref_clk(SFPB_pll_ref_clk), .phy_mgmt_clk(The_clock), .phy_mgmt_clk_reset(m_register_22[0]),
    .ain(inst30_out00), .bin(inst30_out01), .cin(inst30_out02), .din(inst30_out03), .ein(inst30_out04),
    .b_txdatak(inst30_out06), .d_txdatak(inst30_out08), .c_txdatak(inst30_out07), .e_txdatak(inst30_out09),
    .SFP_rx_in(SFPB_rx_in), .a_txdatak(inst30_out05), .a(\04_Fiber_in ), .b(\03_Fiber_in ),
    .c(\02_Fiber_in ), .SFP_Out(SFPB_tx_Out), .d(\01_Fiber_in ), .e(\00_Fiber_in ));  // open: Test_0, Test_1, a_rxdatak, b_rxdatak, c_rxdatak, d_rxdatak, e_rxdatak
  SFP_GxBlock_x5new inst3 (
    .pll_ref_clk(SFPA_pll_ref_clk), .phy_mgmt_clk(The_clock), .phy_mgmt_clk_reset(m_register_22[0]),
    .ain(inst33_out00), .bin(inst33_out01), .cin(inst33_out02), .din(inst33_out03), .ein(inst33_out04),
    .b_txdatak(inst33_out06), .d_txdatak(inst33_out08), .c_txdatak(inst33_out07), .e_txdatak(inst33_out09),
    .SFP_rx_in(SFPA_rx_in), .a_txdatak(inst33_out05), .a(\09_Fiber_in ), .b(\08_Fiber_in ),
    .c(\07_Fiber_in ), .SFP_Out(SFPA_tx_Out), .d(\06_Fiber_in ), .e(\05_Fiber_in ));  // open: Test_0, Test_1, a_rxdatak, b_rxdatak, c_rxdatak, d_rxdatak, e_rxdatak
  SFP_GxBlock inst94 (
    .phy_mgmt_clk(The_clock), .phy_mgmt_clk_reset(m_register_22[0]), .pll_ref_clk(SFP_pll_ref_clk1),
    .SFP_rx_in_0(SFP_rx_in1), .SFP_rx_in_1(SFP_rx_in2), .SFP0_tx_parallel_data(inst50_out00),
    .SFP1_tx_parallel_data(inst50_out02), .SFP_tx0_datak(inst50_out01), .SFP_tx1_datak(inst50_out03),
    .clk(The_clock), .phy_mgmt_addr({9{1'b0}}), .phy_mgmt_read(1'b0), .phy_mgmt_write(1'b0),
    .phy_mgmt_writedata({32{1'b0}}), .SFP_rx0_parallel_data(\10_Fiber_in ), .SFP_Out_0(SFP_tx_Out1),
    .SFP_Out_1(SFP_tx_Out2), .SFP_rx1_datak(debug[3:2]), .SFP_rx1_parallel_data(\11_Fiber_in ),
    .phy_mgmt_readdata(inst94_phy_mgmt_readdata));  // open: SFP_rx0_clkout, SFP_rx0_datak, SFP_rx1_clkout, Test_0_0, Test_0_1, Test_1_0, Test_1_1, Test_0_2, Test_1_2
  SFP_GxBlock inst97 (
    .phy_mgmt_clk(The_clock), .phy_mgmt_clk_reset(m_register_22[0]), .pll_ref_clk(SFP_pll_ref_clk2),
    .SFP_rx_in_0(SFP_rx_in3), .SFP_rx_in_1(SFP_rx_in4), .SFP0_tx_parallel_data(inst278_out00),
    .SFP1_tx_parallel_data(inst278_out02), .SFP_tx0_datak(inst278_out01), .SFP_tx1_datak(inst278_out03),
    .clk(The_clock), .phy_mgmt_addr({9{1'b0}}), .phy_mgmt_read(1'b0), .phy_mgmt_write(1'b0),
    .phy_mgmt_writedata({32{1'b0}}), .SFP_rx0_parallel_data(\12_Fiber_in ), .SFP_Out_0(SFP_tx_Out3),
    .SFP_Out_1(SFP_tx_Out4), .SFP_rx1_parallel_data(\13_Fiber_in ),
    .phy_mgmt_readdata(inst97_phy_mgmt_readdata));  // open: SFP_rx0_clkout, SFP_rx0_datak, SFP_rx1_clkout, SFP_rx1_datak, Test_0_0, Test_0_1, Test_1_0, Test_1_1, Test_0_2, Test_1_2
  SFP_GxBlock inst111 (
    .phy_mgmt_clk(The_clock), .phy_mgmt_clk_reset(m_register_22[0]), .pll_ref_clk(SFP_pll_ref_clk3),
    .SFP_rx_in_0(SFP_rx_in5), .SFP_rx_in_1(SFP_rx_in6), .SFP0_tx_parallel_data(inst279_out00),
    .SFP1_tx_parallel_data(inst279_out02), .SFP_tx0_datak(inst279_out01), .SFP_tx1_datak(inst279_out03),
    .clk(The_clock), .phy_mgmt_addr({9{1'b0}}), .phy_mgmt_read(1'b0), .phy_mgmt_write(1'b0),
    .phy_mgmt_writedata({32{1'b0}}), .SFP_rx0_parallel_data(\14_Fiber_in ), .SFP_Out_0(SFP_tx_Out5),
    .SFP_Out_1(SFP_tx_Out6), .SFP_rx1_parallel_data(\15_Fiber_in ),
    .phy_mgmt_readdata(inst111_phy_mgmt_readdata));  // open: SFP_rx0_clkout, SFP_rx0_datak, SFP_rx1_clkout, SFP_rx1_datak, Test_0_0, Test_0_1, Test_1_0, Test_1_1, Test_0_2, Test_1_2
  dff_one inst122 (.data(LIVE), .clock(The_clock), .q(inst122_q));
  rising_edge inst125 (.clk(The_clock), .pre_sig(inst122_q), .sig(LIVE), .out(LIVE_RISING));
  input_mux inst99 (
    .data1x({16{1'b0}}), .data0x(\00_Fiber_in ), .clock(The_clock), .sel(input_mask[0]),
    .result(inst99_result));
  input_mux inst112 (
    .data1x({16{1'b0}}), .data0x(\01_Fiber_in ), .clock(The_clock), .sel(input_mask[1]),
    .result(inst112_result));
  input_mux inst113 (
    .data1x({16{1'b0}}), .data0x(\02_Fiber_in ), .clock(The_clock), .sel(input_mask[2]),
    .result(inst113_result));
  input_mux inst117 (
    .data1x({16{1'b0}}), .data0x(\03_Fiber_in ), .clock(The_clock), .sel(input_mask[3]),
    .result(inst117_result));
  input_mux inst119 (
    .data1x({16{1'b0}}), .data0x(\04_Fiber_in ), .clock(The_clock), .sel(input_mask[4]),
    .result(inst119_result));
  input_mux inst126 (
    .data1x({16{1'b0}}), .data0x(\05_Fiber_in ), .clock(The_clock), .sel(input_mask[5]),
    .result(inst126_result));
  input_mux inst158 (
    .data1x({16{1'b0}}), .data0x(\06_Fiber_in ), .clock(The_clock), .sel(input_mask[6]),
    .result(inst158_result));
  input_mux inst162 (
    .data1x({16{1'b0}}), .data0x(\07_Fiber_in ), .clock(The_clock), .sel(input_mask[7]),
    .result(inst162_result));
  input_mux inst177 (
    .data1x({16{1'b0}}), .data0x(\08_Fiber_in ), .clock(The_clock), .sel(input_mask[8]),
    .result(inst177_result));
  input_mux inst194 (
    .data1x({16{1'b0}}), .data0x(\09_Fiber_in ), .clock(The_clock), .sel(input_mask[9]),
    .result(inst194_result));
  input_mux inst198 (
    .data1x({16{1'b0}}), .data0x(\10_Fiber_in ), .clock(The_clock), .sel(input_mask[10]),
    .result(inst198_result));
  input_mux inst200 (
    .data1x({16{1'b0}}), .data0x(\11_Fiber_in ), .clock(The_clock), .sel(input_mask[11]),
    .result(inst200_result));
  input_mux inst202 (
    .data1x({16{1'b0}}), .data0x(\12_Fiber_in ), .clock(The_clock), .sel(input_mask[12]),
    .result(inst202_result));
  input_mux inst204 (
    .data1x({16{1'b0}}), .data0x(\13_Fiber_in ), .clock(The_clock), .sel(input_mask[13]),
    .result(inst204_result));
  input_mux inst206 (
    .data1x({16{1'b0}}), .data0x(\14_Fiber_in ), .clock(The_clock), .sel(input_mask[14]),
    .result(inst206_result));
  input_mux inst208 (
    .data1x({16{1'b0}}), .data0x(\15_Fiber_in ), .clock(The_clock), .sel(input_mask[15]),
    .result(inst208_result));
  assign input_mask = vme_register_1[15:0];  // WIRE inst210
  input_identifier inst115 (
    .The_clock(The_clock), .input_data(inst99_result), .data_out(inst115_data_out),
    .get_package(inst115_get_package), .r_spillno(inst115_r_spillno), .r_evtno(inst115_r_evtno));  // open: r_timestamp, r_slotno, r_crateno
  input_identifier inst121 (
    .The_clock(The_clock), .input_data(inst112_result), .data_out(inst121_data_out),
    .get_package(inst121_get_package), .r_spillno(inst121_r_spillno), .r_evtno(inst121_r_evtno));  // open: r_timestamp, r_slotno, r_crateno
  input_identifier inst123 (
    .The_clock(The_clock), .input_data(inst113_result), .data_out(inst123_data_out),
    .get_package(inst123_get_package), .r_spillno(inst123_r_spillno), .r_evtno(inst123_r_evtno));  // open: r_timestamp, r_slotno, r_crateno
  input_identifier inst127 (
    .The_clock(The_clock), .input_data(inst117_result), .data_out(inst127_data_out),
    .get_package(inst127_get_package), .r_spillno(inst127_r_spillno), .r_evtno(inst127_r_evtno));  // open: r_timestamp, r_slotno, r_crateno
  input_identifier inst129 (
    .The_clock(The_clock), .input_data(inst119_result), .data_out(inst129_data_out),
    .get_package(inst129_get_package), .r_spillno(inst129_r_spillno), .r_evtno(inst129_r_evtno));  // open: r_timestamp, r_slotno, r_crateno
  input_identifier inst130 (
    .The_clock(The_clock), .input_data(inst126_result), .data_out(inst130_data_out),
    .get_package(inst130_get_package), .r_spillno(inst130_r_spillno), .r_evtno(inst130_r_evtno));  // open: r_timestamp, r_slotno, r_crateno
  input_identifier inst131 (
    .The_clock(The_clock), .input_data(inst158_result), .data_out(inst131_data_out),
    .get_package(inst131_get_package), .r_spillno(inst131_r_spillno), .r_evtno(inst131_r_evtno));  // open: r_timestamp, r_slotno, r_crateno
  input_identifier inst132 (
    .The_clock(The_clock), .input_data(inst162_result), .data_out(inst132_data_out),
    .get_package(inst132_get_package), .r_spillno(inst132_r_spillno), .r_evtno(inst132_r_evtno));  // open: r_timestamp, r_slotno, r_crateno
  input_identifier inst133 (
    .The_clock(The_clock), .input_data(inst177_result), .data_out(inst133_data_out),
    .get_package(inst133_get_package), .r_spillno(inst133_r_spillno), .r_evtno(inst133_r_evtno));  // open: r_timestamp, r_slotno, r_crateno
  input_identifier inst157 (
    .The_clock(The_clock), .input_data(inst194_result), .data_out(inst157_data_out),
    .get_package(inst157_get_package), .r_spillno(inst157_r_spillno), .r_evtno(inst157_r_evtno));  // open: r_timestamp, r_slotno, r_crateno
  input_identifier inst159 (
    .The_clock(The_clock), .input_data(inst198_result), .data_out(inst159_data_out),
    .get_package(inst159_get_package), .r_spillno(inst159_r_spillno), .r_evtno(inst159_r_evtno));  // open: r_timestamp, r_slotno, r_crateno
  input_identifier inst161 (
    .The_clock(The_clock), .input_data(inst200_result), .data_out(inst161_data_out),
    .get_package(inst161_get_package), .r_spillno(inst161_r_spillno), .r_evtno(inst161_r_evtno));  // open: r_timestamp, r_slotno, r_crateno
  input_identifier inst164 (
    .The_clock(The_clock), .input_data(inst202_result), .data_out(inst164_data_out),
    .get_package(inst164_get_package), .r_spillno(inst164_r_spillno), .r_evtno(inst164_r_evtno));  // open: r_timestamp, r_slotno, r_crateno
  input_identifier inst165 (
    .The_clock(The_clock), .input_data(inst204_result), .data_out(inst165_data_out),
    .get_package(inst165_get_package), .r_spillno(inst165_r_spillno), .r_evtno(inst165_r_evtno));  // open: r_timestamp, r_slotno, r_crateno
  input_identifier inst166 (
    .The_clock(The_clock), .input_data(inst206_result), .data_out(inst166_data_out),
    .get_package(inst166_get_package), .r_spillno(inst166_r_spillno), .r_evtno(inst166_r_evtno));  // open: r_timestamp, r_slotno, r_crateno
  input_identifier inst167 (
    .The_clock(The_clock), .input_data(inst208_result), .data_out(inst167_data_out),
    .get_package(inst167_get_package), .r_spillno(inst167_r_spillno), .r_evtno(inst167_r_evtno));  // open: r_timestamp, r_slotno, r_crateno
  spill_counter inst213 (.clk(The_clock), .reset(reset), .live_rising(LIVE_RISING), .spillno(s_register_100[25:16]));
  counter32_rst inst339 (.sclr(LIVE_RISING), .clock(The_clock), .q(timestamp));
  header_checker inst216 (
    .clk(The_clock), .live_rising(LIVE_RISING), .exp_spillno(s_register_100[25:16]),
    .pkg_evtno(inst115_r_evtno), .pkg_spillno(inst115_r_spillno), .get_package(inst115_get_package),
    .evtno_err(evtno_err[0]), .spillno_err(spillno_err[0]));
  header_checker inst217 (
    .clk(The_clock), .live_rising(LIVE_RISING), .exp_spillno(s_register_100[25:16]),
    .pkg_evtno(inst121_r_evtno), .pkg_spillno(inst121_r_spillno), .get_package(inst121_get_package),
    .evtno_err(evtno_err[1]), .spillno_err(spillno_err[1]));
  header_checker inst218 (
    .clk(The_clock), .live_rising(LIVE_RISING), .exp_spillno(s_register_100[25:16]),
    .pkg_evtno(inst123_r_evtno), .pkg_spillno(inst123_r_spillno), .get_package(inst123_get_package),
    .evtno_err(evtno_err[2]), .spillno_err(spillno_err[2]));
  header_checker inst219 (
    .clk(The_clock), .live_rising(LIVE_RISING), .exp_spillno(s_register_100[25:16]),
    .pkg_evtno(inst127_r_evtno), .pkg_spillno(inst127_r_spillno), .get_package(inst127_get_package),
    .evtno_err(evtno_err[3]), .spillno_err(spillno_err[3]));
  header_checker inst220 (
    .clk(The_clock), .live_rising(LIVE_RISING), .exp_spillno(s_register_100[25:16]),
    .pkg_evtno(inst129_r_evtno), .pkg_spillno(inst129_r_spillno), .get_package(inst129_get_package),
    .evtno_err(evtno_err[4]), .spillno_err(spillno_err[4]));
  header_checker inst221 (
    .clk(The_clock), .live_rising(LIVE_RISING), .exp_spillno(s_register_100[25:16]),
    .pkg_evtno(inst130_r_evtno), .pkg_spillno(inst130_r_spillno), .get_package(inst130_get_package),
    .evtno_err(evtno_err[5]), .spillno_err(spillno_err[5]));
  header_checker inst222 (
    .clk(The_clock), .live_rising(LIVE_RISING), .exp_spillno(s_register_100[25:16]),
    .pkg_evtno(inst131_r_evtno), .pkg_spillno(inst131_r_spillno), .get_package(inst131_get_package),
    .evtno_err(evtno_err[6]), .spillno_err(spillno_err[6]));
  header_checker inst223 (
    .clk(The_clock), .live_rising(LIVE_RISING), .exp_spillno(s_register_100[25:16]),
    .pkg_evtno(inst132_r_evtno), .pkg_spillno(inst132_r_spillno), .get_package(inst132_get_package),
    .evtno_err(evtno_err[7]), .spillno_err(spillno_err[7]));
  header_checker inst224 (
    .clk(The_clock), .live_rising(LIVE_RISING), .exp_spillno(s_register_100[25:16]),
    .pkg_evtno(inst133_r_evtno), .pkg_spillno(inst133_r_spillno), .get_package(inst133_get_package),
    .evtno_err(evtno_err[8]), .spillno_err(spillno_err[8]));
  header_checker inst225 (
    .clk(The_clock), .live_rising(LIVE_RISING), .exp_spillno(s_register_100[25:16]),
    .pkg_evtno(inst157_r_evtno), .pkg_spillno(inst157_r_spillno), .get_package(inst157_get_package),
    .evtno_err(evtno_err[9]), .spillno_err(spillno_err[9]));
  header_checker inst226 (
    .clk(The_clock), .live_rising(LIVE_RISING), .exp_spillno(s_register_100[25:16]),
    .pkg_evtno(inst159_r_evtno), .pkg_spillno(inst159_r_spillno), .get_package(inst159_get_package),
    .evtno_err(evtno_err[10]), .spillno_err(spillno_err[10]));
  header_checker inst227 (
    .clk(The_clock), .live_rising(LIVE_RISING), .exp_spillno(s_register_100[25:16]),
    .pkg_evtno(inst161_r_evtno), .pkg_spillno(inst161_r_spillno), .get_package(inst161_get_package),
    .evtno_err(evtno_err[11]), .spillno_err(spillno_err[11]));
  header_checker inst228 (
    .clk(The_clock), .live_rising(LIVE_RISING), .exp_spillno(s_register_100[25:16]),
    .pkg_evtno(inst164_r_evtno), .pkg_spillno(inst164_r_spillno), .get_package(inst164_get_package),
    .evtno_err(evtno_err[12]), .spillno_err(spillno_err[12]));
  header_checker inst229 (
    .clk(The_clock), .live_rising(LIVE_RISING), .exp_spillno(s_register_100[25:16]),
    .pkg_evtno(inst165_r_evtno), .pkg_spillno(inst165_r_spillno), .get_package(inst165_get_package),
    .evtno_err(evtno_err[13]), .spillno_err(spillno_err[13]));
  header_checker inst230 (
    .clk(The_clock), .live_rising(LIVE_RISING), .exp_spillno(s_register_100[25:16]),
    .pkg_evtno(inst166_r_evtno), .pkg_spillno(inst166_r_spillno), .get_package(inst166_get_package),
    .evtno_err(evtno_err[14]), .spillno_err(spillno_err[14]));
  header_checker inst231 (
    .clk(The_clock), .live_rising(LIVE_RISING), .exp_spillno(s_register_100[25:16]),
    .pkg_evtno(inst167_r_evtno), .pkg_spillno(inst167_r_spillno), .get_package(inst167_get_package),
    .evtno_err(evtno_err[15]), .spillno_err(spillno_err[15]));
  HALF_PACKAGE_LENGTH_516 inst26 (.result(inst26_result));
  MEMORY_DEPTH_24252 inst8 (.result(inst8_result));
  data_storage inst5 (
    .The_clock(The_clock), .live_rising(LIVE_RISING), .get_package(inst115_get_package),
    .raddr(inst281_raddr), .input_data(inst115_data_out), .half_package_length(inst26_result),
    .memory_depth(inst8_result), .data_out(inst5_data_out), .complete(w_complete[0]));
  data_storage inst24 (
    .The_clock(The_clock), .live_rising(LIVE_RISING), .get_package(inst121_get_package),
    .raddr(inst281_raddr), .input_data(inst121_data_out), .half_package_length(inst26_result),
    .memory_depth(inst8_result), .data_out(inst24_data_out), .complete(w_complete[1]));
  data_storage inst172 (
    .The_clock(The_clock), .live_rising(LIVE_RISING), .get_package(inst123_get_package),
    .raddr(inst281_raddr), .input_data(inst123_data_out), .half_package_length(inst26_result),
    .memory_depth(inst8_result), .data_out(inst172_data_out), .complete(w_complete[2]));
  data_storage inst173 (
    .The_clock(The_clock), .live_rising(LIVE_RISING), .get_package(inst127_get_package),
    .raddr(inst281_raddr), .input_data(inst127_data_out), .half_package_length(inst26_result),
    .memory_depth(inst8_result), .data_out(inst173_data_out), .complete(w_complete[3]));
  data_storage inst174 (
    .The_clock(The_clock), .live_rising(LIVE_RISING), .get_package(inst129_get_package),
    .raddr(inst281_raddr), .input_data(inst129_data_out), .half_package_length(inst26_result),
    .memory_depth(inst8_result), .data_out(inst174_data_out), .complete(w_complete[4]));
  data_storage inst175 (
    .The_clock(The_clock), .live_rising(LIVE_RISING), .get_package(inst130_get_package),
    .raddr(inst281_raddr), .input_data(inst130_data_out), .half_package_length(inst26_result),
    .memory_depth(inst8_result), .data_out(inst175_data_out), .complete(w_complete[5]));
  data_storage inst176 (
    .The_clock(The_clock), .live_rising(LIVE_RISING), .get_package(inst131_get_package),
    .raddr(inst281_raddr), .input_data(inst131_data_out), .half_package_length(inst26_result),
    .memory_depth(inst8_result), .data_out(inst176_data_out), .complete(w_complete[6]));
  data_storage inst232 (
    .The_clock(The_clock), .live_rising(LIVE_RISING), .get_package(inst132_get_package),
    .raddr(inst281_raddr), .input_data(inst132_data_out), .half_package_length(inst26_result),
    .memory_depth(inst8_result), .data_out(inst232_data_out), .complete(w_complete[7]));
  data_storage inst280 (
    .The_clock(The_clock), .live_rising(LIVE_RISING), .get_package(inst133_get_package),
    .raddr(inst281_raddr), .input_data(inst133_data_out), .half_package_length(inst26_result),
    .memory_depth(inst8_result), .data_out(inst280_data_out), .complete(w_complete[8]));
  data_storage inst283 (
    .The_clock(The_clock), .live_rising(LIVE_RISING), .get_package(inst157_get_package),
    .raddr(inst281_raddr), .input_data(inst157_data_out), .half_package_length(inst26_result),
    .memory_depth(inst8_result), .data_out(inst283_data_out), .complete(w_complete[9]));
  data_storage inst311 (
    .The_clock(The_clock), .live_rising(LIVE_RISING), .get_package(inst159_get_package),
    .raddr(inst281_raddr), .input_data(inst159_data_out), .half_package_length(inst26_result),
    .memory_depth(inst8_result), .data_out(inst311_data_out), .complete(w_complete[10]));
  data_storage inst312 (
    .The_clock(The_clock), .live_rising(LIVE_RISING), .get_package(inst161_get_package),
    .raddr(inst281_raddr), .input_data(inst161_data_out), .half_package_length(inst26_result),
    .memory_depth(inst8_result), .data_out(inst312_data_out), .complete(w_complete[11]));
